# EAGLE design Weihnachtsstern (EAGLE 9.6.2)
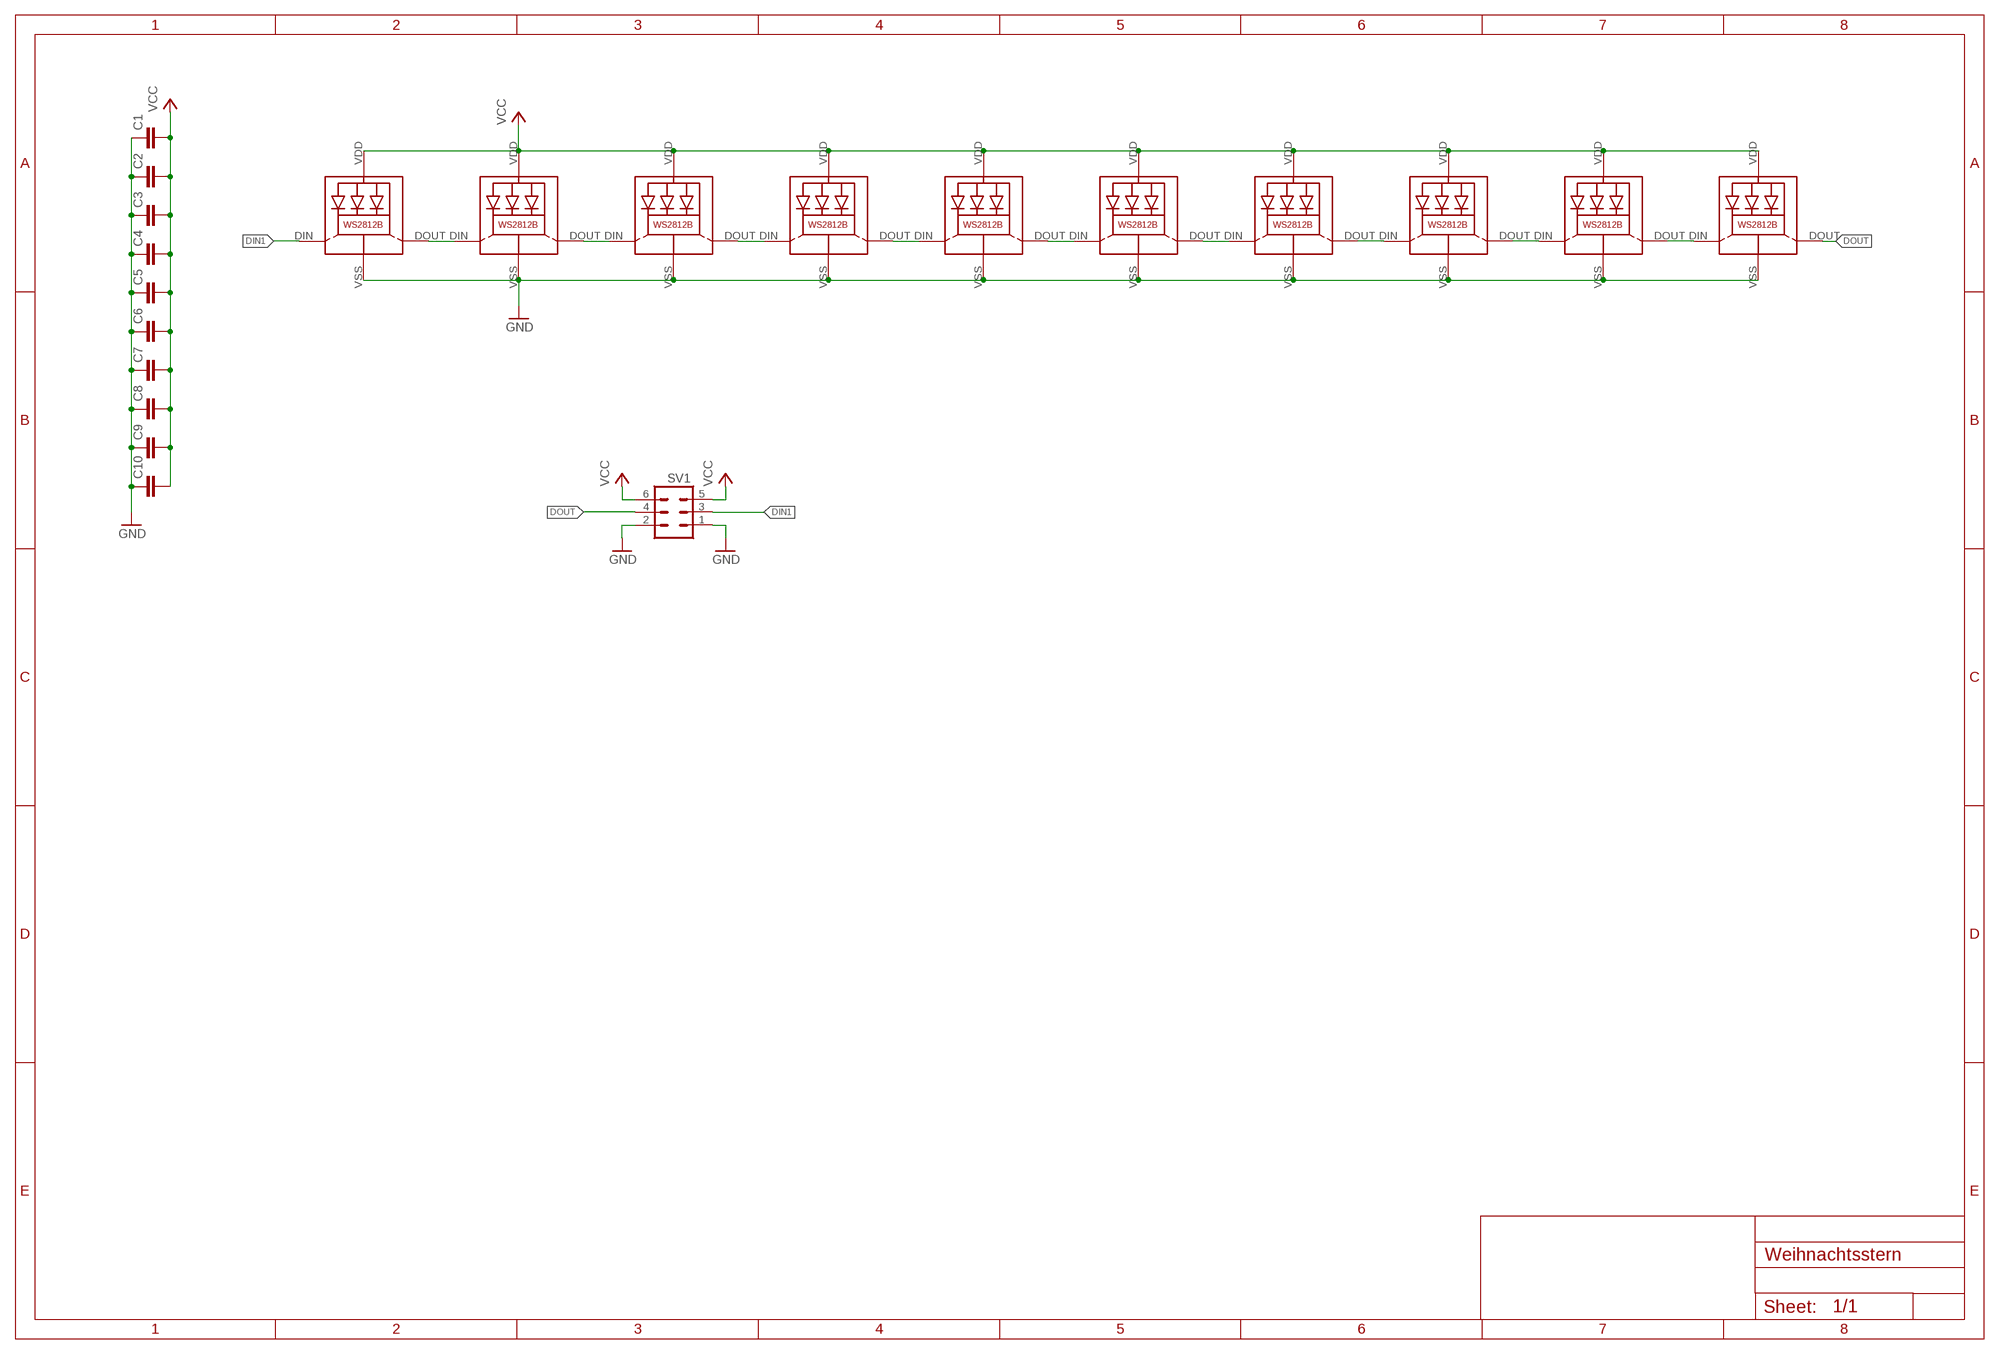
[diagram p0: schematic, sheet 1]

## Parts
C1  C-EUC0805  [C0805]
C2  C-EUC0805  [C0805]
C3  C-EUC0805  [C0805]
C4  C-EUC0805  [C0805]
C5  C-EUC0805  [C0805]
C6  C-EUC0805  [C0805]
C7  C-EUC0805  [C0805]
C8  C-EUC0805  [C0805]
C9  C-EUC0805  [C0805]
C10  C-EUC0805  [C0805]
LED1  WS2812B  [WS2812B]
LED2  WS2812B  [WS2812B]
LED3  WS2812B  [WS2812B]
LED4  WS2812B  [WS2812B]
LED5  WS2812B  [WS2812B]
LED6  WS2812B  [WS2812B]
LED7  WS2812B  [WS2812B]
LED8  WS2812B  [WS2812B]
LED9  WS2812B  [WS2812B]
LED10  WS2812B  [WS2812B]
SV1  MA03-2  [MA03-2]

## Nets
DIN1: LED1.DIN(DI) SV1.3
DOUT: LED10.DOUT(DO) SV1.4
GND: C1.1 C2.1 C3.1 C4.1 C5.1 C6.1 C7.1 C8.1 C9.1 C10.1 LED1.VSS(GND) LED2.VSS(GND) LED3.VSS(GND) LED4.VSS(GND) LED5.VSS(GND) LED6.VSS(GND) LED7.VSS(GND) LED8.VSS(GND) LED9.VSS(GND) LED10.VSS(GND) SV1.1 SV1.2
N$1: LED1.DOUT(DO) LED2.DIN(DI)
N$2: LED2.DOUT(DO) LED3.DIN(DI)
N$3: LED3.DOUT(DO) LED4.DIN(DI)
N$4: LED4.DOUT(DO) LED5.DIN(DI)
N$5: LED5.DOUT(DO) LED6.DIN(DI)
N$6: LED6.DOUT(DO) LED7.DIN(DI)
N$7: LED7.DOUT(DO) LED8.DIN(DI)
N$8: LED8.DOUT(DO) LED9.DIN(DI)
N$9: LED9.DOUT(DO) LED10.DIN(DI)
VCC: C1.2 C2.2 C3.2 C4.2 C5.2 C6.2 C7.2 C8.2 C9.2 C10.2 LED1.VDD LED2.VDD LED3.VDD LED4.VDD LED5.VDD LED6.VDD LED7.VDD LED8.VDD LED9.VDD LED10.VDD SV1.5 SV1.6

## Library data of the parts
C1-C10 = rcl:C-EU: CAPACITOR, European symbol; SPICEPREFIX: C
LED1-LED10 = WS2812B:WS2812B: Features and Benefits  * Intelligent reverse connect protection, the power supply reverse connection does not damage the IC. * The control circuit and the LED share the only power source. Control circuit and RGB chip are integrated in a package of 5050 components, form a complete control of pixel point.  * Built-in signal reshaping circuit, after wave reshaping to the next driver, ensure wave-form distortion not accumulate.  * Built-in electric reset circuit and power lost reset circuit.  * Each pixel of the three primary color can achieve 256 brightness display, completed 16777216 color full color display, and scan frequency not less than 400Hz/s.  * Cascading port transmission signal by single line.  * Any two point the distance more than 5m transmission signal without any increase circuit.  * When the refresh rate is 30fps, cascade number are not less than1024 points.  * Send data at speeds of 800Kbps.  *The color of the light were highly consistent, cost-effective. Applications  Full-color module, Full color soft lights a lamp strip. LED decorative lighting, Indoor/outdoor LED video irregular screen. General description WS2812B is a intelligent control LED light source that the control circuit and RGB chip are integrated in a package of 5050 components. It internal include intelligent digital port data latch and signal reshaping amplification drive circuit. Also include a precision internal oscillator and a 12V voltage programmable constant curre-nt control part, effectively ensuring the pixel point light color height consistent. The data transfer protocol use single NZR communication mode. After the pixel power-on reset, the DIN port receive data from controller, the first pixel collect initial 24bit data then sent to the internal data latch, the other data which reshaping by the internal signal reshaping amplification circuit sent to the next cascade pixel through the DO port. After transmission for each pixel,the signal to reduce 24bit. pixel adopt auto reshaping transmit technology, making the pixel cascade number is not limited the signal transmission, only depend on the speed of signal transmission. LED with low driving voltage, environmental protection and energy saving, high brightness, scattering angle is large, good consistency, low power, long life and other advantages. The control chip integrated in LED above becoming more simple circuit, small volume, convenient installation. Absolute Maximum Ratings Power supply voltage: VDD +3.5V..+5.3V Input voltage: VI -0.5V..VDD+0.5V based on WS2812 from https://github.com/adafruit/Adafruit-Eagle-Library
SV1 = con-eigen:MA03-2: PIN HEADER; OC_FARNELL: unknown; OC_NEWARK: unknown

## Net classes
0 default: width 0.152 mm, drill 0.305 mm, clearance 0.254 mm

## Board
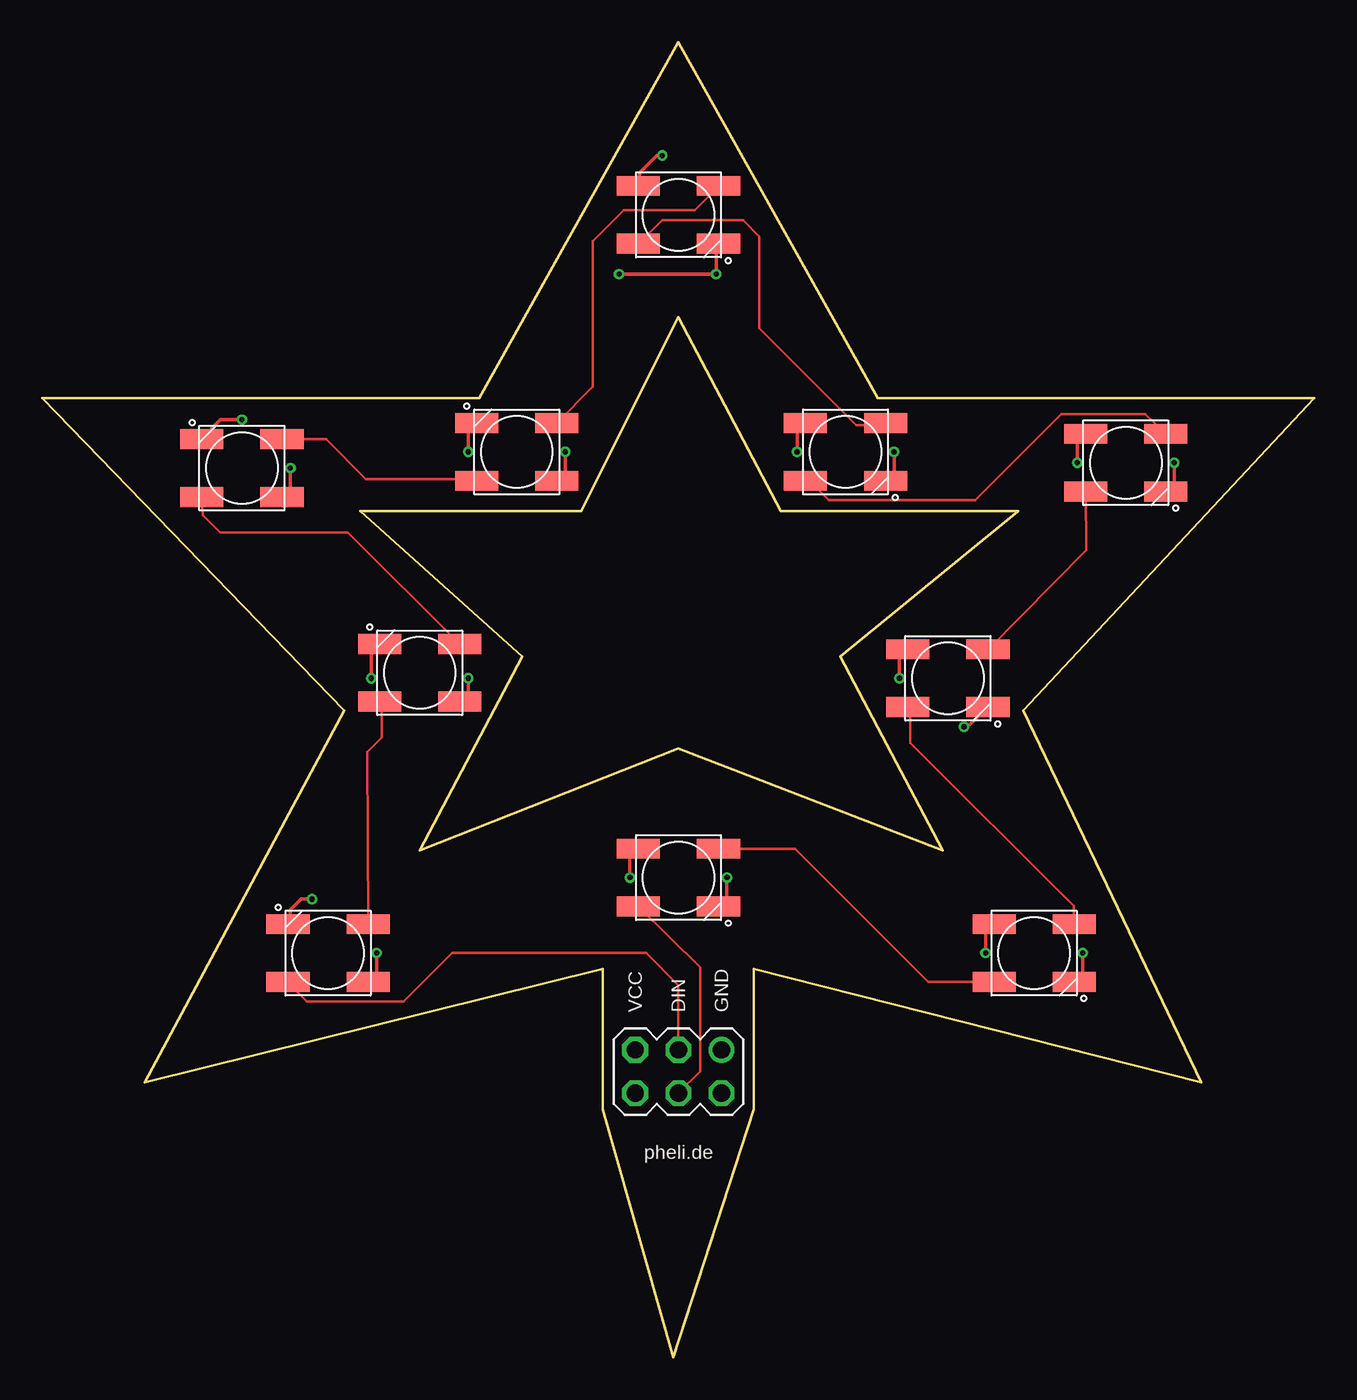
[diagram p1: board, top side]
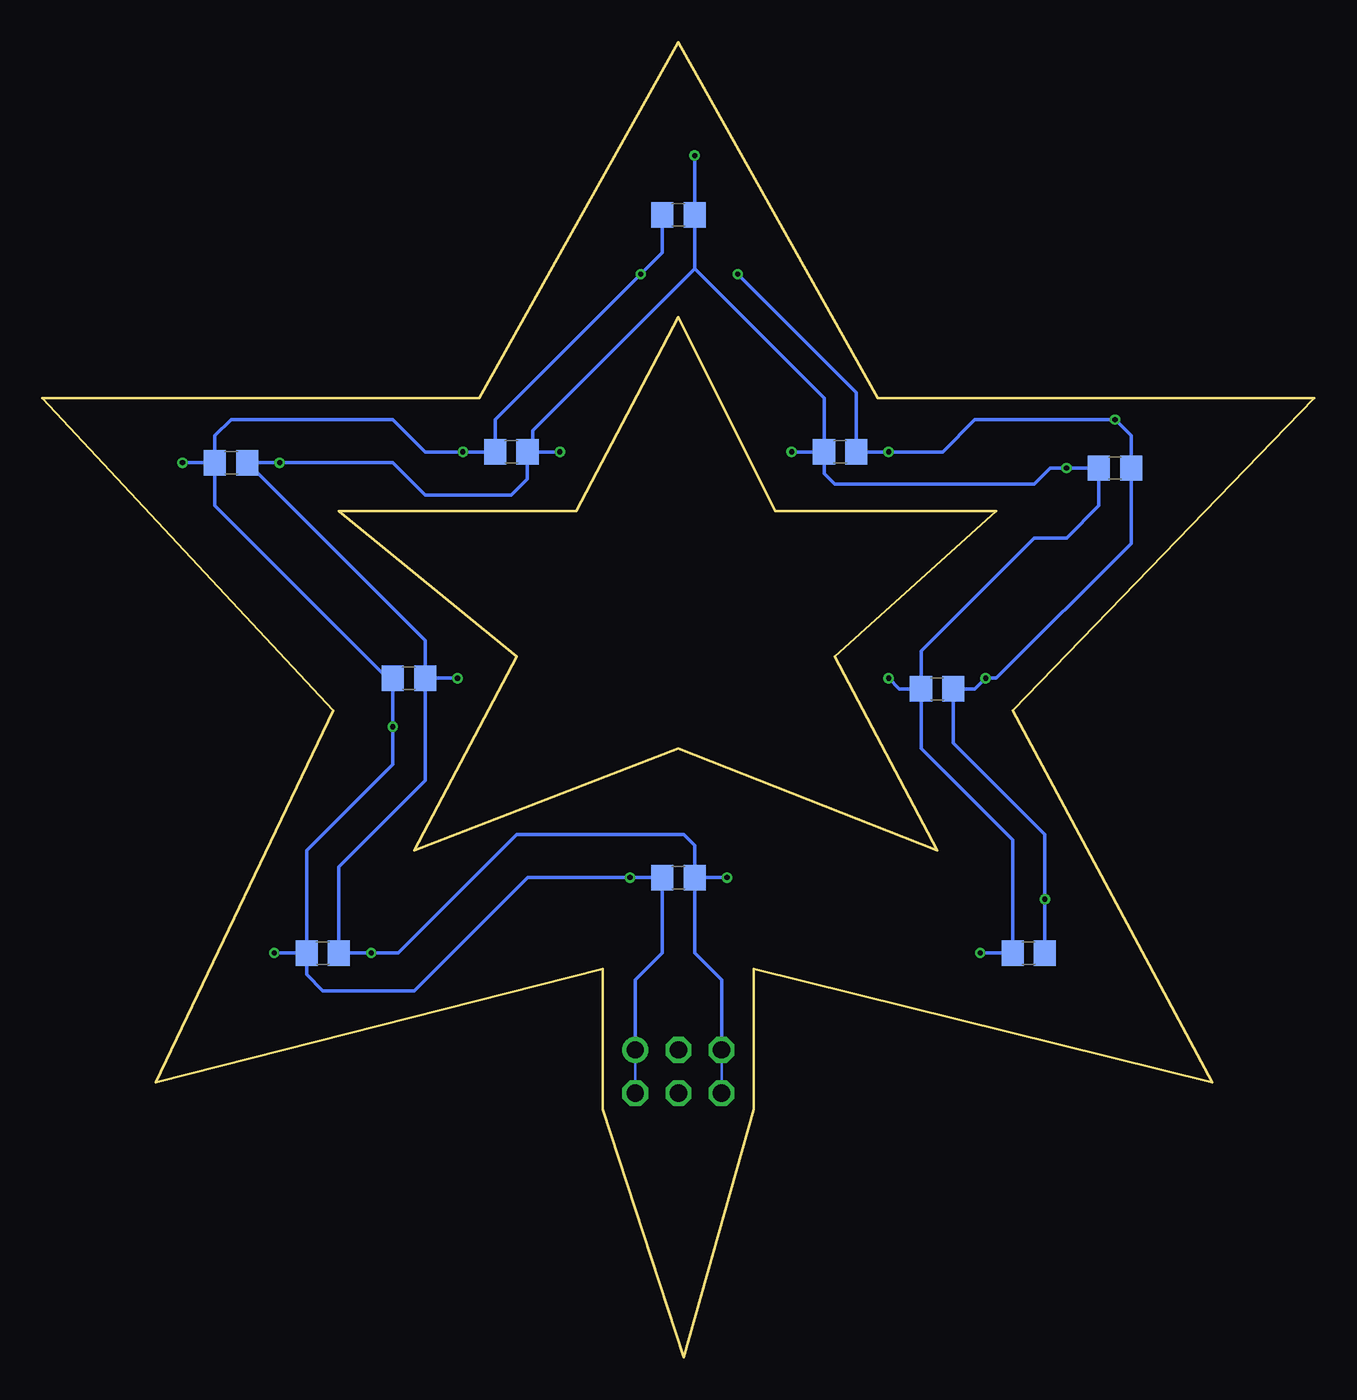
[diagram p2: board, bottom side, seen from below]

Size 74.93 x 77.47 mm. Coordinates in mm from the lower left corner, seen from the top.
Outline: 0,56.52 25.72,56.52 37.46,77.47 49.21,56.52 74.93,56.52 57.78,38.1 68.26,16.19 41.91,22.86 41.91,14.6 37.15,0 33.02,14.6 33.02,22.86 6.03,16.19 17.78,38.1 0,56.52
Outline: 18.73,49.85 31.75,49.85 37.46,61.28 43.5,49.85 57.47,49.85 46.99,41.28 53.02,29.85 37.46,35.88 22.23,29.85 28.26,41.28 18.73,49.85
Copper layers (1*16): Top 0.035mm / dielectric 1.6mm / Bottom 0.035mm
Design rules "Elecrow_2-layer_PCB_eagle_rule": minimum track width 6mil, minimum drill 12mil, track to track 6mil, track to pad 6mil, pad to pad 6mil, via to via 8mil, smd to smd 0mil, copper to edge 20mil, drill to drill 10mil, minimum pad ring 6mil, minimum via ring 6mil, stop-mask expansion 0mil, vias tented up to drill 100mil, thermal gap 10mil

### Footprints (pad centres in the part's own frame; a part is rotated, then mirrored left to right if it is on the bottom)
C0805 = smd 1.3 x 1.5: 1 -0.95,0; 2 0.95,0
WS2812B = smd 2.54 x 1.168: DIN 2.362,1.7; DOUT -2.362,-1.7; VDD -2.362,1.7; VSS 2.362,-1.7
MA03-2 = drill 1.016: 1 -2.54,-1.27 | drill 1.016 octagon: 2 -2.54,1.27; 3 0,-1.27; 4 0,1.27; 5 2.54,-1.27; 6 2.54,1.27

### Placement (x,y rotation side)
C1  16.83,23.81 180 bottom
C2  22.23,39.37 180 bottom
C3  11.75,52.39 180 bottom
C4  27.94,53.34 180 bottom
C5  37.46,67.31 0 bottom
C6  47.31,53.34 0 bottom
C7  63.82,52.7 0 bottom
C8  53.34,40 0 bottom
C9  58.42,23.81 0 bottom
C10  37.46,28.26 0 bottom
LED1  16.83,23.81 180 top
LED2  22.23,40.32 180 top
LED3  11.75,52.39 180 top
LED4  27.94,53.34 180 top
LED5  37.46,67.31 0 top
LED6  47.31,53.34 0 top
LED7  63.82,52.7 0 top
LED8  53.34,40 0 top
LED9  58.42,23.81 0 top
LED10  37.46,28.26 0 top
SV1  37.46,16.83 180 top

### Tracks (layer width: path | path; a pad name or v marks a point on that pad's centre or on a via)
DIN1
  Top 0.152: SV1.3 37.46,21.91 35.56,23.81 24.13,23.81 21.27,20.95 15.56,20.95 14.51,22 LED1.DIN
DOUT
  Top 0.152: LED10.DOUT 38.73,22.97 38.73,16.83 SV1.4
GND  (via drill 0.3)
  Top 0.203: LED4.VSS 25.08,54.5 v25.08,53.34 | LED3.VSS 9.43,54.2 10.48,55.24 v11.75,55.24 | LED2.VSS 19.37,41.48 v19.37,40 | LED1.VSS 14.6,25.61 14.6,26.35 15.24,26.99 v15.88,26.99 | v40.32,28.26 40.32,27.1 LED10.VSS | v61.28,23.81 61.28,22.65 LED9.VSS | LED8.VSS 54.5,37.15 v54.29,37.15 | v66.67,52.7 66.67,51.55 LED7.VSS | v33.97,63.82 v39.69,63.82 39.69,65.52 LED5.VSS | v50.16,53.34 50.16,52.14 LED6.VSS
  Bottom 0.152: SV1.1 SV1.2
  Bottom 0.203: SV1.1 40,22.22 38.41,23.81 C10.1 v40.32,28.26 46.35,28.26 53.02,21.59 58.42,21.59 59.37,22.54 C9.1 | C9.1 59.37,29.53 59.37,29.85 54.29,34.93 v54.29,37.15 54.29,39.69 | 54.29,39.69 C8.1 | C7.1 64.77,50.17 54.29,39.69 | C7.1 64.77,54.29 63.82,55.24 54.29,55.24 52.39,53.34 v50.16,53.34 C6.1 48.26,55.25 v39.69,63.82 38.41,65.09 C5.1 | v33.97,63.82 26.99,56.83 C4.1 v25.08,53.34 21.91,53.34 20,55.24 v11.75,55.24 10.8,54.3 C3.1 10.8,47.94 18.73,40 v19.37,40 20,39.37 C2.1 21.27,36.2 15.88,30.8 v15.88,26.99 C1.1 | C9.1 v61.28,23.81 | C7.1 v66.67,52.7
N$1
  Top 0.152: LED1.DOUT 19.15,35.66 20,36.51 20,38.53 LED2.DIN
N$2
  Top 0.152: LED2.DOUT 17.99,48.58 10.48,48.58 9.43,49.63 LED3.DIN
N$3
  Top 0.152: LED3.DOUT 16.72,54.09 19.05,51.75 25.51,51.75 LED4.DIN
N$4
  Top 0.152: LED4.DOUT 32.41,57.19 32.41,65.75 34.25,67.59 38.42,67.59 39.83,69 LED5.DIN
N$5
  Top 0.152: LED5.DOUT 36.52,66.98 41.27,66.98 42.23,66.03 42.23,60.64 47.94,54.93 49.51,54.93 LED6.DIN
N$6
  Top 0.152: LED6.DOUT 45.2,51.64 46.33,50.51 54.95,50.51 60.01,55.56 64.98,55.56 LED7.DIN
N$7
  Top 0.152: LED7.DOUT 61.5,47.55 LED8.DIN
N$8
  Top 0.152: LED8.DOUT 51.12,38.21 51.12,36.2 60.74,26.58 LED9.DIN
N$9
  Top 0.152: LED9.DOUT 52.18,22.11 44.34,29.96 LED10.DIN
VCC  (via drill 0.3)
  Top 0.203: v30.8,53.34 30.8,52.18 LED4.VDD | v14.6,52.39 14.6,51.23 LED3.VDD | v25.08,40 25.08,39.16 LED2.VDD | v19.69,23.81 19.69,22.65 LED1.VDD | v34.61,28.26 34.61,29.42 LED10.VDD | LED9.VDD 55.56,24.97 v55.56,23.81 | LED8.VDD 50.48,41.17 v50.48,40 | LED7.VDD 60.96,53.86 v60.96,52.7 | v44.45,53.34 44.45,54.5 LED6.VDD | v36.51,70.8 36.2,70.8 35.18,69.79 LED5.VDD
  Bottom 0.152: SV1.5 SV1.6
  Bottom 0.203: SV1.5 34.92,22.22 36.52,23.81 C10.2 | C10.2 36.51,30.16 37.15,30.8 46.99,30.8 53.97,23.81 v55.56,23.81 C9.2 57.47,28.89 52.39,33.97 C8.2 | C8.2 52.39,42.23 C7.2 v60.96,52.7 54.29,52.7 52.39,50.8 47.31,50.8 46.36,51.75 C6.2 | C6.2 46.04,53.34 46.04,54.61 36.51,64.14 | 36.51,64.14 C5.2 v36.51,70.8 | C4.2 28.89,56.51 36.51,64.14 | C4.2 28.89,52.07 28.26,51.43 16.51,51.43 15.56,52.39 v14.6,52.39 C3.2 12.7,50.17 14.6,48.26 16.51,48.26 23.17,41.6 C2.2 | C2.2 23.17,35.88 17.78,30.48 C1.2 v19.69,23.81 | C4.2 v30.8,53.34 | C2.2 24.45,39.37 v25.08,40 | C10.2 v34.61,28.26 | v50.48,40 C8.2 | C6.2 v44.45,53.34

### Text on the board
tPlace: VCC | DIN | GND | pheli.de